# Altium project OPID[360] MCU.PrjPcb
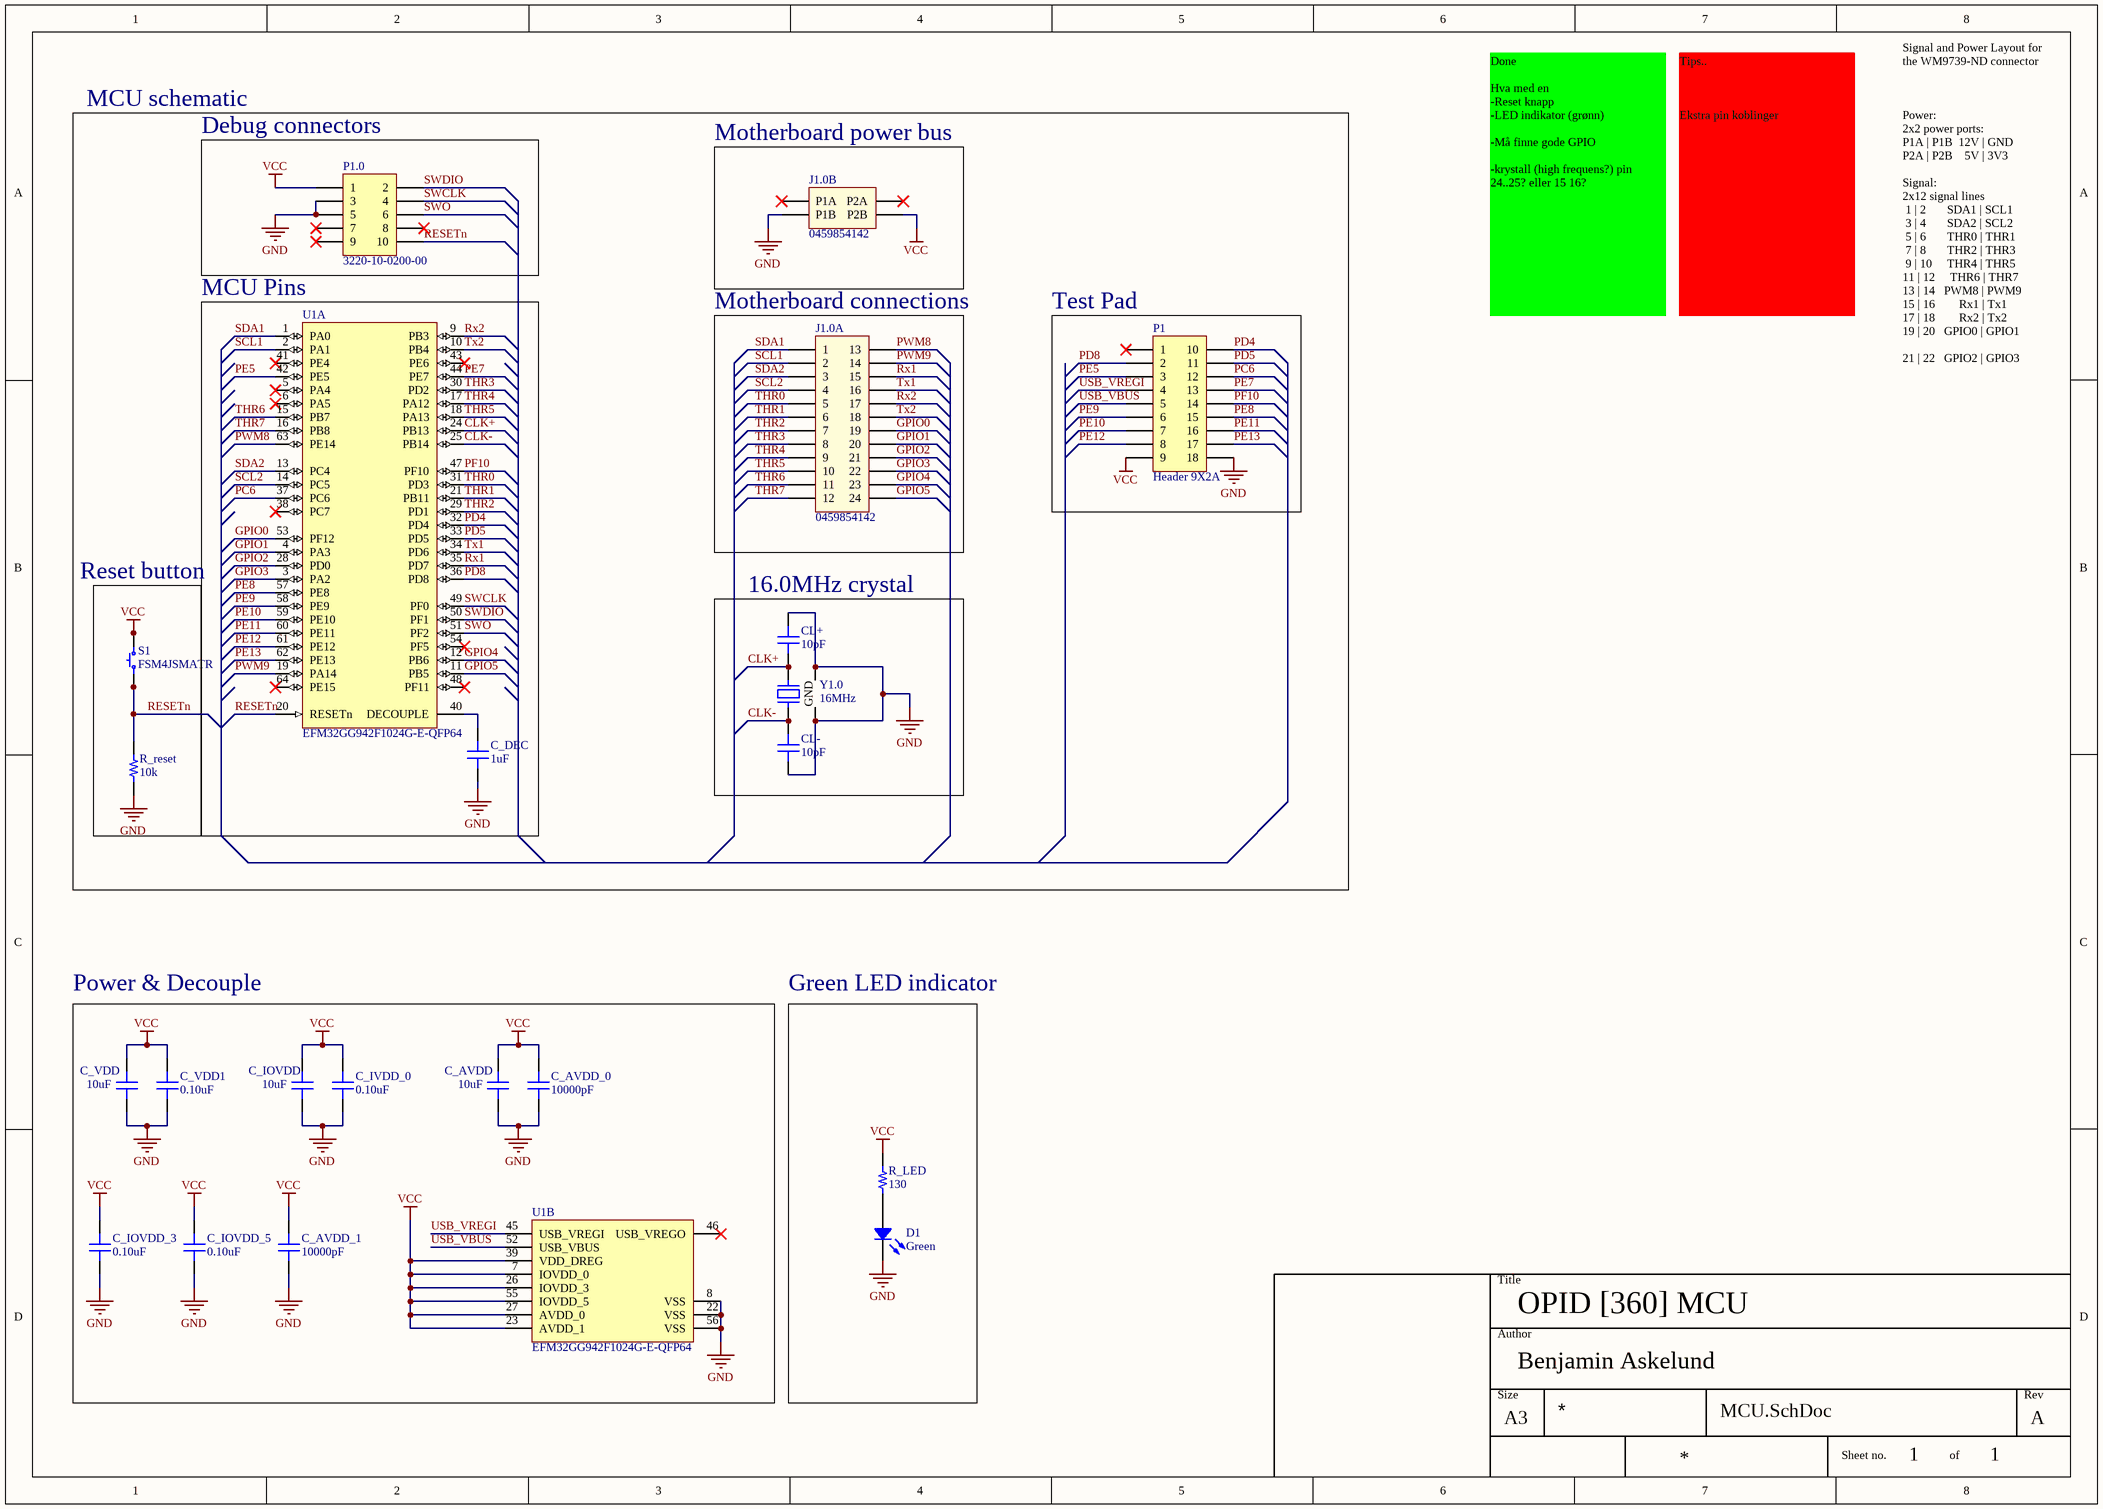
[diagram p0: MCU.SchDoc]
1 sheet, 22 parts. Net scope: global (net labels, ports and power ports of the same name join across sheets).
Board file: MCU_PCB.PcbDoc

## Sheet MCU.SchDoc: OPID [360] MCU
size A3; Author: Benjamin Askelund; Revision: A; SheetNumber: 1; SheetTotal: 1

### Parts
(Parts that share a designator on the sheet are numbered #1, #2 ... from top to bottom, then left to right.)
C_AVDD  10uF  [CAP 0805/2012]
C_AVDD_0  10000pF  [CAP 0805/2012]
C_AVDD_1  10000pF  [CAP 0805/2012]
C_DEC  1uF  [CAP 0805/2012]
C_IOVDD  10uF  [CAP 0805/2012]
C_IOVDD_3  0.10uF  [CAP 0805/2012]
C_IOVDD_5  0.10uF  [CAP 0805/2012]
C_IVDD_0  0.10uF  [CAP 0805/2012]
C_VDD  10uF  [CAP 0805/2012]
C_VDD1  0.10uF  [CAP 0805/2012]
CL+  10pF  [CAP 0805/2012]
CL-  10pF  [CAP 0805/2012]
D1  Green  [LED 0805/2012 GREEN]
J1.0  0459854142  [CONN_HEADER_4PWR_24SGL_2.36MM]  (parts A,B of 2)
P1  Header 9X2A  [HDR2X9_CEN]
P1.0  3220-10-0200-00  [HDRRA10W40P127_2X5_1265X750X540P]
R_LED  130  [RES 0805/2012]
R_reset  10k  [RES 0805/2012]
S1  FSM4JSMATR  [TE FSM4JSMA]
U1#1  EFM32GG942F1024G-E-QFP64  [TQFP64_N]  (part A of 2)
U1#2  EFM32GG942F1024G-E-QFP64  [TQFP64_N]  (part B of 2)
Y1.0  16MHz  [NDK NX2520SA]

### Blocks framed on the sheet
Debug connectors: P1.0
Motherboard power bus: J1.0
MCU Pins: C_DEC U1#1
Motherboard connections: J1.0
Test Pad: P1
16.0MHz crystal: CL+ CL- Y1.0
Power & Decouple: C_AVDD C_AVDD_0 C_AVDD_1 C_IOVDD C_IOVDD_3 C_IOVDD_5 C_IVDD_0 C_VDD C_VDD1 U1#2
Green LED indicator: D1 R_LED

### Nets
GND: C_AVDD.1 C_AVDD_0.2 C_AVDD_1.2 C_DEC.1 C_IOVDD.1 C_IOVDD_3.1 C_IOVDD_5.1 C_IVDD_0.1 C_VDD.1 C_VDD1.1 CL+.2 CL-.1 D1.2 J1.0.P1B P1.18 P1.0.3 P1.0.5 R_reset.1 U1#2.8(VSS) U1#2.22(VSS) U1#2.56(VSS) Y1.0.2(GND) Y1.0.4(GND)
VCC: C_AVDD.2 C_AVDD_0.1 C_AVDD_1.1 C_IOVDD.2 C_IOVDD_3.2 C_IOVDD_5.2 C_IVDD_0.2 C_VDD.2 C_VDD1.2 J1.0.P2B P1.9 P1.0.1 R_LED.2 S1.3 S1.4 U1#2.7(IOVDD_0) U1#2.23(AVDD_1) U1#2.26(IOVDD_3) U1#2.27(AVDD_0) U1#2.39(VDD_DREG) U1#2.55(IOVDD_5)
CLK+: CL+.1 U1#1.24(PB13) Y1.0.3
CLK-: CL-.2 U1#1.25(PB14) Y1.0.1
GPIO0: J1.0.19 U1#1.53(PF12)
GPIO1: J1.0.20 U1#1.4(PA3)
GPIO2: J1.0.21 U1#1.28(PD0)
GPIO3: J1.0.22 U1#1.3(PA2)
GPIO4: J1.0.23 U1#1.12(PB6)
GPIO5: J1.0.24 U1#1.11(PB5)
PC6: P1.12 U1#1.37(PC6)
PD4: P1.10 U1#1.32(PD4)
PD5: P1.11 U1#1.33(PD5)
PD8: P1.2 U1#1.36(PD8)
PE5: P1.3 U1#1.42(PE5)
PE7: P1.13 U1#1.44(PE7)
PE8: P1.15 U1#1.57(PE8)
PE9: P1.6 U1#1.58(PE9)
PE10: P1.7 U1#1.59(PE10)
PE11: P1.16 U1#1.60(PE11)
PE12: P1.8 U1#1.61(PE12)
PE13: P1.17 U1#1.62(PE13)
PF10: P1.14 U1#1.47(PF10)
PWM8: J1.0.13 U1#1.63(PE14)
PWM9: J1.0.14 U1#1.19(PA14)
RESETn: P1.0.10 R_reset.2 S1.1 S1.2 U1#1.20(RESETn)
Rx1: J1.0.15 U1#1.35(PD7)
Rx2: J1.0.17 U1#1.9(PB3)
SCL1: J1.0.2 U1#1.2(PA1)
SCL2: J1.0.4 U1#1.14(PC5)
SDA1: J1.0.1 U1#1.1(PA0)
SDA2: J1.0.3 U1#1.13(PC4)
SWCLK: P1.0.4 U1#1.49(PF0)
SWDIO: P1.0.2 U1#1.50(PF1)
SWO: P1.0.6 U1#1.51(PF2)
THR0: J1.0.5 U1#1.31(PD3)
THR1: J1.0.6 U1#1.21(PB11)
THR2: J1.0.7 U1#1.29(PD1)
THR3: J1.0.8 U1#1.30(PD2)
THR4: J1.0.9 U1#1.17(PA12)
THR5: J1.0.10 U1#1.18(PA13)
THR6: J1.0.11 U1#1.15(PB7)
THR7: J1.0.12 U1#1.16(PB8)
Tx1: J1.0.16 U1#1.34(PD6)
Tx2: J1.0.18 U1#1.10(PB4)
USB_VBUS: P1.5 U1#2.52(USB_VBUS)
USB_VREGI: P1.4 U1#2.45(USB_VREGI)
NetC_DEC_2: C_DEC.2 U1#1.40(DECOUPLE)
NetD1_1: D1.1 R_LED.1

Not connected (* = marked no-connect by the designer): J1.0 P1A* P2A*; P1 1*; P1.0 7* 8* 9*; U1#1 5(PA4)* 6(PA5)* 38(PC7)* 41(PE4)* 43(PE6)* 48(PF11)* 54(PF5)* 64(PE15)*; U1#2 46(USB_VREGO)*

### Notes on the sheet
- MCU schematic
- Done
  Hva med en
  -Reset knapp
  -LED indikator (grønn)
  -Må finne gode GPIO
  -krystall (high frequens?) pin 24..25? eller 15 16?
- Tips..
  Ekstra pin koblinger
- Signal and Power Layout for
  the WM9739-ND connector
  Power:
  2x2 power ports:
  P1A | P1B  12V | GND
  P2A | P2B    5V | 3V3
  Signal:
  2x12 signal lines
  1 | 2       SDA1 | SCL1
  3 | 4       SDA2 | SCL2
  5 | 6       THR0 | THR1
  7 | 8       THR2 | THR3
  9 | 10     THR4 | THR5
  11 | 12     THR6 | THR7
  13 | 14   PWM8 | PWM9
  15 | 16        Rx1 | Tx1
  17 | 18        Rx2 | Tx2
  19 | 20   GPIO0 | GPIO1
  21 | 22   GPIO2 | GPIO3
  23 | 24   GPIO4 | GPIO5
- Reset button
- Title
- Size
- Author
- Rev
- A3
- Sheet no.
- of

### Library data of the parts
C_AVDD C_IOVDD C_VDD = JMK212BJ106KD-T: CAP CER 10UF 6.3V X5R 0805; Manufacturer: Taiyo Yuden; TemperatureRange: -55C ~ 85C; Tolerance: 10%; Value: 10uF; Part Number: JMK212BJ106KD-T; PartId: 13750; Supplier 1: Digi-Key; Supplier Part Number 1: 587-1304-2-ND; ComponentLink1Description: Datasheet; ComponentLink1URL: http://www.yuden.co.jp/productdata/catalog/en/mlcc_all_e.pdf; ComponentLink2Description: Digi-Key Listing; ComponentLink2URL: https://www.digikey.com/product-detail/en/taiyo-yuden/JMK212BJ106KD-T/587-1304-2-ND/930656; TemperatureCoefficient: X5R; Voltage: 6.3V; Price: 0,032; Device Package: 0805 (2012 Metric)
C_AVDD_0 C_AVDD_1 = CC0805JRX7R9BB103: CAP CER 10000PF 50V X7R 0805; Manufacturer: Yageo; TemperatureRange: -55C ~ 125C; Tolerance: 5%; Value: 10000pF; Part Number: CC0805JRX7R9BB103; PartId: 5807; Supplier 1: Digi-Key; Supplier Part Number 1: 311-1857-2-ND; ComponentLink1Description: Datasheet; ComponentLink1URL: http://www.yageo.com/documents/recent/UPY-GPHC_X7R_6.3V-to-50V-v12.pdf; ComponentLink2Description: Digi-Key listing; ComponentLink2URL: http://digikey.com/product-detail/en/CC0805JRX7R9BB103/311-1857-2-ND/5195264; TemperatureCoefficient: X7R; Voltage: 50V; Price: 0,0193; Type: -; Device Package: 0805 (2012 Metric)
C_DEC = GRM219R71E105KA88D: CAP CER 1UF 25V X7R 0805; Manufacturer: Murata Electronics North America; TemperatureRange: -55C ~ 125C; Tolerance: 10%; Value: 1uF; Part Number: GRM219R71E105KA88D; PartId: 14171; Supplier 1: Digi-Key; Supplier Part Number 1: 490-5899-2-ND; ComponentLink1Description: Datasheet; ComponentLink1URL: http://www.murata.com/~/media/webrenewal/support/library/catalog/products/capacitor/mlcc/c02e.pdf; ComponentLink2Description: Digi-Key Listing; ComponentLink2URL: https://www.digikey.com/product-detail/en/murata-electronics-north-america/GRM219R71E105KA88D/490-5899-2-ND/2546469; TemperatureCoefficient: X7R; Voltage: 25V; Price: 0,0422; Device Package: 0805 (2012 Metric)
C_IOVDD_3 C_IOVDD_5 C_IVDD_0 C_VDD1 = GRM21BR71E104KA01L: CAP CER 0.1UF 25V X7R 0805; Manufacturer: Murata Electronics North America; TemperatureRange: -55C ~ 125C; Tolerance: 10%; Value: 0.10uF; Part Number: GRM21BR71E104KA01L; PartId: 13708; Supplier 1: Digi-Key; Supplier Part Number 1: 490-1673-2-ND; ComponentLink1Description: Datasheet; ComponentLink1URL: http://www.murata.com/~/media/webrenewal/support/library/catalog/products/capacitor/mlcc/c02e.pdf; ComponentLink2Description: Digi-Key Listing; ComponentLink2URL: https://www.digikey.com/product-detail/en/murata-electronics-north-america/GRM21BR71E104KA01L/490-1673-2-ND/586699; TemperatureCoefficient: X7R; Voltage: 25V; Price: 0,0092; Device Package: 0805 (2012 Metric)
CL+ CL- = C0805C100J1GACTU: CAP CER 10PF 100V NP0 0805; Manufacturer: Kemet; TemperatureRange: -55C ~ 125C; TemperatureCoefficient: C0G, NP0; Tolerance: 5%; Value: 10pF; Part Number: C0805C100J1GACTU; PartId: 14386; Supplier 1: Digi-Key; Supplier Part Number 1: 399-1109-2-ND; ComponentLink1Description: Datasheet; ComponentLink1URL: http://www.kemet.com/docfinder?Partnumber=C0805C100J1GACTU; ComponentLink2Description: Digi-Key Listing; ComponentLink2URL: https://www.digikey.com/product-detail/en/kemet/C0805C100J1GACTU/399-1109-2-ND/411108; Voltage: 100V; Price: 0,0236; Device Package: 0805 (2012 Metric)
D1 = LTST-C171KGKT: LED GREEN CLEAR 0805 SMD; Manufacturer: Lite-On Inc.; Type: Surface Mount; Millicandela: 35mcd; Voltage Forward: 2V; Current (Test): 20mA; Viewing Angle: 130; Value: Green; Part Number: LTST-C171KGKT; PartId: 7080; Supplier 1: Digi-Key; Supplier Part Number 1: 160-1426-2-ND; ComponentLink1Description: Datasheet; ComponentLink1URL: http://optoelectronics.liteon.com/upload/download/DS22-2000-118/S_110_LTST-C171KGKT.pdf; ComponentLink2Description: Digi-Key Listing; ComponentLink2URL: http://www.digikey.ca/product-detail/en/LTST-C171KGKT/160-1426-2-ND/386799; Price: 0,0638; Device Package: 0805 (2012 Metric); Colour: Green; Lens Transparency: Clear
J1.0 = 0459854142: Number Of Positions: 28; Part Number: 0459854142; ComponentLink1Description: Manufacturer Link; ComponentLink1URL: http://www.molex.com/; ComponentLink2Description: Datasheet; ComponentLink2URL: http://www.molex.com/pdm_docs/sd/459854111_sd.pdf; Supplier 1: Digi-Key; Supplier Part Number 1: WM8736-ND; Number Of Rows: 2; Mounting Type: Through Hole
P1 = Header 9X2A: Header, 9-Pin, Dual row; LatestRevisionDate: 17-Jul-2002; LatestRevisionNote: Re-released for DXP Platform.; Publisher: Altium Limited
P1.0 = 3220-10-0200-00: Number Of Positions: 10; Part Number: 3220-10-0200-00; ComponentLink1Description: Manufacturer Link; ComponentLink1URL: http://www.cnctech.us/; ComponentLink2Description: Datasheet; ComponentLink2URL: http://cnctech.us/pdfs/3220-XX-0200-00.pdf; Supplier 1: Digi-Key; Supplier Part Number 1: 1175-1628-ND; Number Of Rows: 2; Mounting Type: Through Hole
R_LED = ERJ-6ENF1300V: RES SMD 130 OHM 1% 1/8W 0805; Manufacturer: Panasonic Electronic Components; TemperatureRange: -55C ~ 155C; TemperatureCoefficient: 100ppm/C; PowerRating: 0.125W, 1/8W; Value: 130; Part Number: ERJ-6ENF1300V; PartId: 2345; Supplier 1: Digi-Key; Supplier Part Number 1: P130CTR-ND; ComponentLink1Description: Datasheet; ComponentLink1URL: http://industrial.panasonic.com/www-cgi/jvcr13pz.cgi?E+PZ+3+AOA0002+ERJ6ENF1300V+7+WW; ComponentLink2Description: Digi-Key listing; ComponentLink2URL: http://digikey.com/product-detail/en/ERJ-6ENF1300V/P130CTR-ND/111111; Tolerance: 1%; Price: 0,0073; Type: Thick Film; Device Package: 0805 (2012 Metric)
R_reset = ERJ-6ENF1002V: RES SMD 10K OHM 1% 1/8W 0805; Manufacturer: Panasonic Electronic Components; TemperatureRange: -55C ~ 155C; TemperatureCoefficient: 100ppm/C; PowerRating: 0.125W, 1/8W; Value: 10k; Part Number: ERJ-6ENF1002V; PartId: 1947; Supplier 1: Digi-Key; Supplier Part Number 1: P10.0KCTR-ND; ComponentLink1Description: Datasheet; ComponentLink1URL: http://industrial.panasonic.com/www-cgi/jvcr13pz.cgi?E+PZ+3+AOA0002+ERJ6ENF1002V+7+WW; ComponentLink2Description: Digi-Key listing; ComponentLink2URL: http://digikey.com/product-detail/en/ERJ-6ENF1002V/P10.0KCTR-ND/111474; Tolerance: 1%; Price: 0,0073; Type: Thick Film; Device Package: 0805 (2012 Metric)
S1 = FSM4JSMATR: SWITCH TACTILE SPST-NO 0.05A 24V; Manufacturer: TE Connectivity Alcoswitch Switches; Switch Function: Off-Mom; Contact Rating @ Voltage: 0.05A @ 24VDC; Actuator Type: Standard; Actuator Orientation: Top Actuated; Illumination: Non-Illuminated; Operating Force: 160gf; Switch Travel: 0.25mm; Mechanical Life: 100,000 Cycles; Part Number: FSM4JSMATR; PartId: 8249; Supplier 1: Digi-Key; Supplier Part Number 1: 450-1759-2-ND; ComponentLink1Description: Datasheet; ComponentLink1URL: http://www.te.com/commerce/DocumentDelivery/DDEController?Action=srchrtrv&DocNm=2-1437565-7&DocType=Customer+Drawing&DocLang=English; ComponentLink2Description: Digi-Key Listing; ComponentLink2URL: http://www.digikey.com/product-detail/en/FSM4JSMATR/450-1759-2-ND/529675; Price: 0,128; Circuit: SPST-NO; Illumination Voltage: -; Illumination Type, Colour: -; Operating Temperature: -35C ~ 85C
Y1.0 = NX2520SA-16.000000MHZ: CRYSTAL 16.0000MHZ 10PF SMD; Manufacturer: NDK; Frequency Stability: 10ppm; ESR: 80 Ohm; Operating Mode: Fundamental; Part Number: NX2520SA-16.000000MHZ; PartId: 8496; Supplier 1: Digi-Key; Supplier Part Number 1: 644-1059-2-ND; ComponentLink1Description: Datasheet; ComponentLink1URL: http://media.digikey.com/pdf/Data%20Sheets/NDK%20PDFs/NX2520SA.pdf; ComponentLink2Description: Digi-Key Listing; ComponentLink2URL: http://www.digikey.com/product-detail/en/NX2520SA-16.000000MHZ/644-1059-2-ND/1128841; Price: 0,7336; Type: MHz Crystal; Device Package: 4-SMD, No Lead (DFN, LCC); Frequency: 16MHz; Frequency Tolerance: 10ppm; Load Capacitance: 10pF
U1#1 U1#2 = EFM32GG942F1024G-E-QFP64: Part Number: EFM32GG942F1024G-E-QFP64; ComponentLink1Description: Manufacturer Link; ComponentLink1URL: https://www.silabs.com; ComponentLink2Description: Datasheet; ComponentLink2URL: https://www.silabs.com/documents/public/data-sheets/EFM32GG942.pdf; Supplier 1: Digi-Key; Supplier Part Number 1: 336-4157-ND